# EAGLE design digAudio-OC0808 (EAGLE 9.6.2)
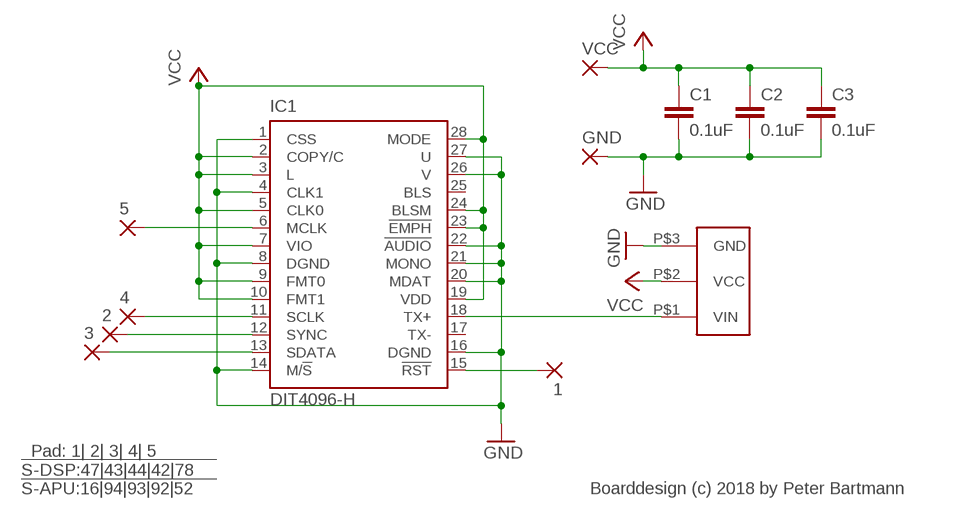
[diagram p0: schematic, sheet 1]

## Parts
1  SMD1  [SMD0,8-1,6]
2  SMD1  [SMD0,8-1,6]
3  SMD1  [SMD0,8-1,6]
4  SMD1  [SMD0,8-1,6]
5  SMD1  [SMD0,8-1,6]
C1  0.1uF  C-EUC0603  [C0603]
C2  0.1uF  C-EUC0603  [C0603]
C3  0.1uF  C-EUC0603  [C0603]
GND  SMD2  [SMD1,27-2,54]
IC1  DIT4096-H  DIT4192-H  [PW_R-PDSO-G28]
U$1  JT_OC0808  [JT_OC-0808T*008]
VCC  SMD2  [SMD1,27-2,54]

## Nets
GND: C1.2 C2.2 C3.2 GND.1(P) IC1.1(CSS) IC1.4(CLK1) IC1.8(DGND) IC1.14(M/!S) IC1.16(DGND) IC1.20(MDAT) IC1.21(MONO) IC1.22(!AUDIO) IC1.26(V) IC1.27(U) U$1.P$3(GND)
N$1: IC1.18(TX+) U$1.P$1(VIN)
N$2: 1.P$1(P) IC1.15(!RST)
N$3: 2.P$1(P) IC1.12(SYNC)
N$4: 4.P$1(P) IC1.11(SCLK)
N$5: 3.P$1(P) IC1.13(SDATA)
N$6: 5.P$1(P) IC1.6(MCLK)
VCC: C1.1 C2.1 C3.1 IC1.2(COPY/C) IC1.3(L) IC1.5(CLK0) IC1.7(VIO) IC1.9(FMT0) IC1.10(FMT1) IC1.19(VDD) IC1.23(!EMPH) IC1.24(BLSM) IC1.28(MODE) U$1.P$2(VCC) VCC.1(P)
Unconnected: IC1.17(TX-) IC1.25(BLS)

## Notes on the sheet
- Pad: 1| 2| 3| 4| 5
  S-DSP:47|43|44|42|78
  S-APU:16|94|93|92|52
- Boarddesign (c) 2018 by Peter Bartmann

## Library data of the parts
1-5 = wirepad:SMD1
C1-C3 = rcl:C-EU: CAPACITOR, European symbol
GND VCC = wirepad:SMD2: SMD PAD
IC1 = texas:DIT4192-H: 192kHz Digital Audio Transmitter Hardware Mode Source: http://focus.ti.com/lit/ds/symlink/dit4192.pdf; MF: TEXAS INSTRUMENTS; MPN: DIT4192IPW; OC_FARNELL: 7455057; OC_NEWARK: 74C9511
U$1 = cs8406:JT_OC0808

## Board
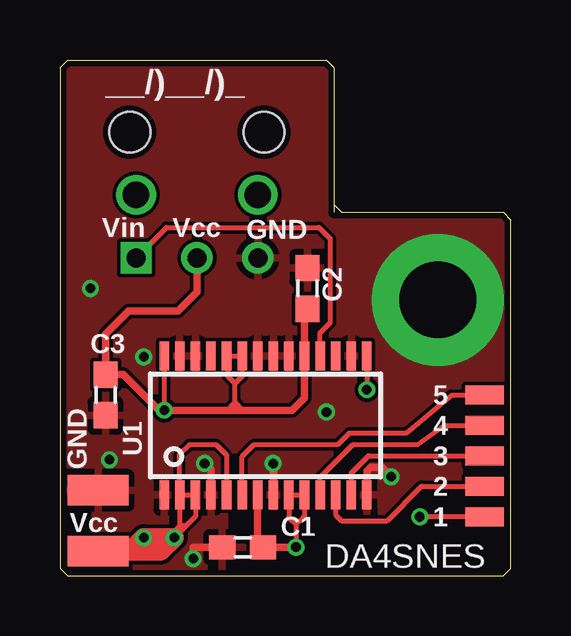
[diagram p1: board, top side]
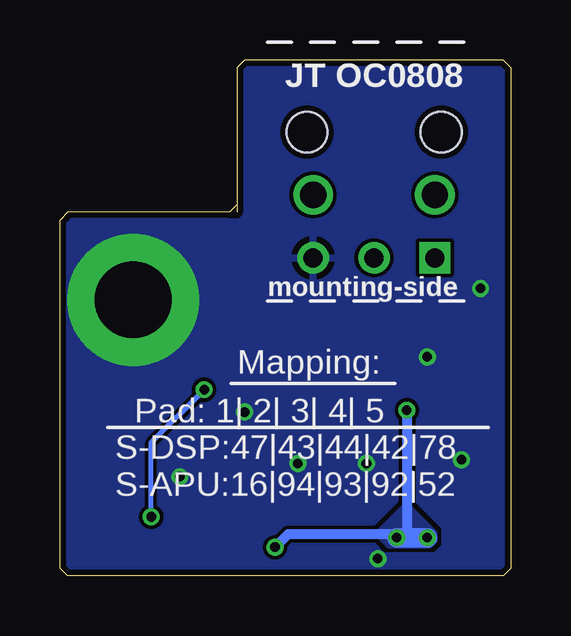
[diagram p2: board, bottom side, seen from below]

Size 18.81 x 21.51 mm. Coordinates in mm from the lower left corner, seen from the top.
Outline: 11.43,15.48 11.43,21.19 11.11,21.51 0.32,21.51 0,21.19 0,0.32 0.32,0 18.49,0 18.81,0.32 18.81,14.84 18.49,15.16 11.75,15.16 11.43,15.48
Outline: 11.43,15.48 11.43,15.16
Copper layers (1*16): Top 0.035mm / dielectric 1.5mm / Bottom 0.035mm
Design rules "Elecrow_2-layer_eagle_rule": minimum track width 6mil, minimum drill 12mil, track to track 6mil, track to pad 6mil, pad to pad 6mil, via to via 6mil, smd to smd 0mil, copper to edge 10mil, drill to drill 10mil, minimum pad ring 10mil, minimum via ring 6mil, stop-mask expansion 2mil, vias tented up to drill 100mil, thermal gap 10mil
tRestrict: 4 lines

### Footprints (pad centres in the part's own frame; a part is rotated, then mirrored left to right if it is on the bottom)
SMD0,8-1,6 = smd 0.8 x 1.6: P$1 0,0
C0603 = smd 1.1 x 1: 1 -0.85,0; 2 0.85,0
SMD1,27-2,54 = smd 1.27 x 2.54: 1 0,0
PW_R-PDSO-G28 = smd 0.4 x 1.2: 1 -4.225,-2.9; 2 -3.575,-2.9; 3 -2.925,-2.9; 4 -2.275,-2.9; 5 -1.625,-2.9; 6 -0.975,-2.9; 7 -0.325,-2.9; 8 0.325,-2.9; 9 0.975,-2.9; 10 1.625,-2.9; 11 2.275,-2.9; 12 2.925,-2.9; 13 3.575,-2.9; 14 4.225,-2.9; 15 4.225,2.9; 16 3.575,2.9; 17 2.925,2.9; 18 2.275,2.9; 19 1.625,2.9; 20 0.975,2.9; 21 0.325,2.9; 22 -0.325,2.9; 23 -0.975,2.9; 24 -1.625,2.9; 25 -2.275,2.9; 26 -2.925,2.9; 27 -3.575,2.9; 28 -4.225,2.9
JT_OC-0808T*008 = drill 0.8 square: P$1 2.54,0 | drill 0.8: P$2 0,0; P$3 -2.54,0 | drill 1.1: P$4 2.54,2.63; P$5 -2.54,2.63 | hole 1.7: -2.8,5.24; 2.8,5.24

### Placement (x,y rotation side)
1  17.7,2.46 90 top
2  17.7,3.73 90 top
3  17.7,5 90 top
4  17.7,6.27 90 top
5  17.7,7.54 90 top
C1  7.62,1.19 180 top
C2  10.32,11.99 90 top
C3  1.91,7.54 270 top
GND  1.59,3.57 270 top
IC1  8.57,6.27 0 top
U$1  5.71,13.26 0 bottom
VCC  1.59,1.03 90 top

### Tracks (layer width: path | path; a pad name or v marks a point on that pad's centre or on a via)
GND  (via drill 0.4, 3.2 pad 5.5)
  Top 0.305: IC1.14 12.8,4.36 12.95,4.51 13.42,4.51 v13.81,4.13 | IC1.8 v8.9,4.68 v8.89,4.68 | IC1.4 6.3,4.42 v6.03,4.68 | v5.56,0.71 5.56,1.19 C1.2
  other vias: 15.76,11.51 3.49,9.13 1.27,11.99 2.06,4.84 11.11,6.83
  pour Bottom (rank 6): -0.64,-0.08 19.05,-0.08 19.05,21.51 -0.64,21.51
  pour Top: -0.64,-0.08 -0.64,21.51 19.05,21.51 19.05,-0.08
N$1
  Top 0.203: IC1.18 10.85,10.13 11.27,10.56 11.27,14.05 10.79,14.53 4.45,14.53 U$1.P$1
N$2  (via drill 0.4)
  Top 0.203: 1.P$1 v15,2.46 | IC1.15 v12.8,7.76
  Bottom 0.203: v15,2.46 15,5.56 v12.8,7.76
N$3
  Top 0.203: IC1.12 11.5,2.55 11.75,2.3 13.65,2.3 15.08,3.73 2.P$1
N$4
  Top 0.203: IC1.11 10.85,4.1 12.22,5.48 14.92,5.48 16.03,6.27 4.P$1
N$5
  Top 0.203: 3.P$1 12.86,5 12.15,4.29 IC1.13
N$6
  Top 0.203: 5.P$1 16.35,7.54 14.45,5.95 12.06,5.95 11.59,5.48 8.1,5.48 7.6,4.98 IC1.6
VCC  (via drill 0.4)
  Top 0.203: 9.84,2.14 9.68,2.3 | 9.68,2.3 9.55,2.44 IC1.9 IC1.10 10.2,2.5 10,2.3 | 10,2.3 9.84,2.14 | 9.84,2.14 v9.84,1.19 | IC1.2 IC1.3 5.65,2.47 5.28,2.1 | 9.68,2.3 10,2.3 | 7.3,7.22 7.3,8.02 | 7.3,8.02 6.99,8.33 6.99,9.13 IC1.24 IC1.23 7.6,8.31 7.3,8.02 | 7.3,7.22 7.3,6.91 | 6.03,6.91 6.99,6.91 7.3,7.22 | 7.3,7.22 7.62,6.91 | IC1.28 v4.35,6.91 | IC1.2 5,5.08 5.4,5.48 6.51,5.48 6.95,5.04 IC1.5 | 5.28,2.1 v4.76,1.59 | IC1.2 5,2.06 | 5,2.06 4.76,1.83 | 5,2.06 5.04,2.1 5.28,2.1
  Top 0.305: IC1.7 8.25,1.29 C1.1 v9.84,1.19 | C2.1 10.22,11.03 10.16,11.03 10.2,10.59 IC1.19 10.2,7.42 9.68,6.91 7.62,6.91 7.3,6.91 6.03,6.91 v4.35,6.91 4.13,6.91 2.64,8.39 C3.1 1.91,10.08 2.86,11.03 4.92,11.03 5.71,11.83 U$1.P$2
  Top 0.813: 1.75,1.19 VCC.1 | VCC.1 2.94,1.03 v3.49,1.59 v4.76,1.59 4.21,1.03 VCC.1
  Bottom 0.406: v9.84,1.19 9.29,1.75 4.92,1.75 v4.76,1.59 | 4.29,1.59 4.35,1.65 v4.35,6.91
  Bottom 0.813: v3.49,1.59 4.29,1.59 v4.76,1.59
  pour Bottom: 3.25,1.59 3.25,1.75 4.37,2.86 5.48,1.75 5.08,1.35 3.41,1.35 3.25,1.51

### Text on the board
tNames: __/)__/)_ | Vin | Vcc | GND | C2 | C3 | 5 | 4 | GND | U1 | 3 | 2 | Vcc | C1 | 1 | DA4SNES
bNames: Mapping: | Pad: 1| 2| 3| 4| 5 / S-DSP:47|43|44|42|78 / S-APU:16|94|93|92|52